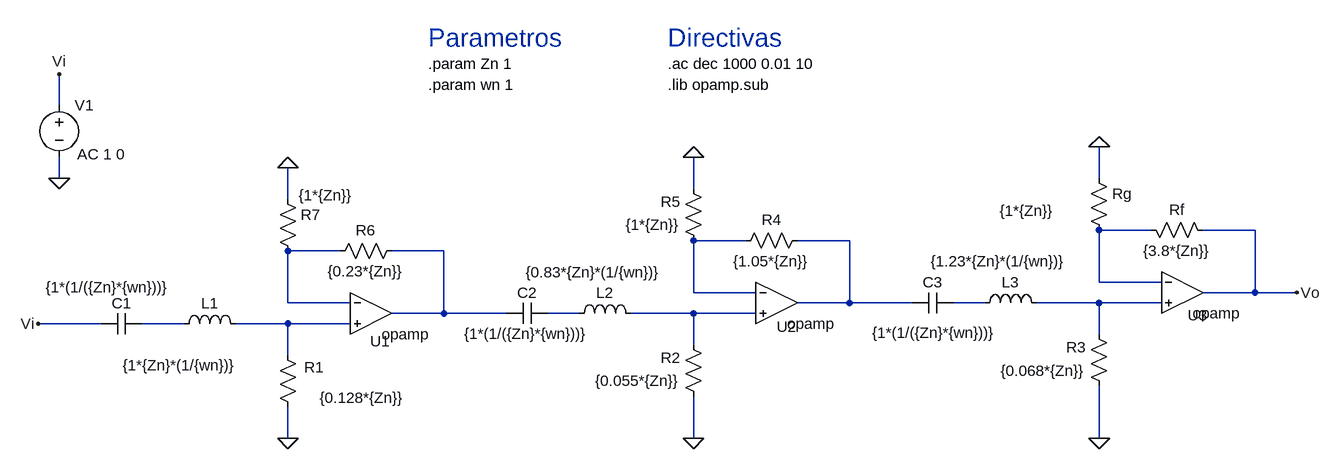
[diagram p0: schematic Circuito_Seroe.asc]
Circuito_Seroe.asc, the LTspice schematic file:
Version 4
SHEET 1 1968 680
WIRE -336 -208 -336 -256
WIRE -336 -96 -336 -128
WIRE 1264 -96 1264 -144
WIRE 640 -80 640 -128
WIRE 16 -64 16 -112
WIRE 1344 -16 1264 -16
WIRE 1504 -16 1424 -16
WIRE 720 0 640 0
WIRE 880 0 800 0
WIRE 96 16 16 16
WIRE 256 16 176 16
WIRE 1264 64 1264 -16
WIRE 1360 64 1264 64
WIRE 640 80 640 0
WIRE 736 80 640 80
WIRE 1504 80 1504 -16
WIRE 1504 80 1424 80
WIRE 1568 80 1504 80
WIRE 16 96 16 16
WIRE 112 96 16 96
WIRE 880 96 880 0
WIRE 880 96 800 96
WIRE 976 96 880 96
WIRE 1088 96 1040 96
WIRE 1264 96 1168 96
WIRE 1360 96 1264 96
WIRE 256 112 256 16
WIRE 256 112 176 112
WIRE 352 112 256 112
WIRE 464 112 416 112
WIRE 640 112 544 112
WIRE 736 112 640 112
WIRE -272 128 -368 128
WIRE -144 128 -208 128
WIRE 16 128 -64 128
WIRE 112 128 16 128
WIRE 1264 144 1264 96
WIRE 640 160 640 112
WIRE 16 176 16 128
WIRE 16 304 16 256
WIRE 640 304 640 240
WIRE 1264 304 1264 224
FLAG 16 304 0
FLAG -368 128 Vi
FLAG -336 -256 Vi
FLAG -336 -96 0
FLAG 640 304 0
FLAG 1264 304 0
FLAG 1568 80 Vo
FLAG 1264 -144 0
FLAG 640 -128 0
FLAG 16 -112 0
SYMBOL OpAmps\\opamp 144 48 R0
WINDOW 0 -1 107 Left 2
SYMATTR InstName U1
SYMBOL res 32 272 R180
WINDOW 0 -40 77 Left 2
WINDOW 3 -164 30 Left 2
SYMATTR InstName R1
SYMATTR Value {0.128*{Zn}}
SYMBOL cap -208 112 R90
WINDOW 3 -56 52 VTop 2
WINDOW 0 0 32 VBottom 2
SYMATTR Value {1*(1/({Zn}*{wn}))}
SYMATTR InstName C1
SYMBOL ind -160 144 R270
WINDOW 0 32 56 VTop 2
WINDOW 3 -32 10 VBottom 2
SYMATTR InstName L1
SYMATTR Value {1*{Zn}*(1/{wn})}
SYMBOL OpAmps\\opamp 768 32 R0
WINDOW 0 0 101 Left 2
SYMATTR InstName U2
SYMBOL res 656 256 R180
WINDOW 0 36 76 Left 2
WINDOW 3 36 40 Left 2
SYMATTR InstName R2
SYMATTR Value {0.055*{Zn}}
SYMBOL cap 416 96 R90
WINDOW 3 32 32 VTop 2
WINDOW 0 0 32 VBottom 2
SYMATTR Value {1*(1/({Zn}*{wn}))}
SYMATTR InstName C2
SYMBOL ind 448 128 R270
WINDOW 0 32 56 VTop 2
WINDOW 3 95 39 VBottom 2
SYMATTR InstName L2
SYMATTR Value {0.83*{Zn}*(1/{wn})}
SYMBOL OpAmps\\opamp 1392 16 R0
WINDOW 0 8 99 Left 2
SYMATTR InstName U3
SYMBOL res 1280 240 R180
WINDOW 0 36 76 Left 2
WINDOW 3 36 40 Left 2
SYMATTR InstName R3
SYMATTR Value {0.068*{Zn}}
SYMBOL cap 1040 80 R90
WINDOW 3 46 28 VTop 2
WINDOW 0 0 32 VBottom 2
SYMATTR Value {1*(1/({Zn}*{wn}))}
SYMATTR InstName C3
SYMBOL ind 1072 112 R270
WINDOW 0 32 56 VTop 2
WINDOW 3 96 38 VBottom 2
SYMATTR InstName L3
SYMATTR Value {1.23*{Zn}*(1/{wn})}
SYMBOL voltage -336 -224 R0
WINDOW 123 28 91 Left 2
WINDOW 39 0 0 Left 0
SYMATTR Value2 AC 1 0
SYMATTR InstName V1
SYMATTR Value ""
SYMBOL res 1248 -112 R0
WINDOW 3 -137 66 Left 2
SYMATTR Value {1*{Zn}}
SYMATTR InstName Rg
SYMBOL res 1328 -32 M90
WINDOW 0 0 56 VBottom 2
WINDOW 3 32 56 VTop 2
SYMATTR InstName Rf
SYMATTR Value {3.8*{Zn}}
SYMBOL res 816 -16 R90
WINDOW 0 0 56 VBottom 2
WINDOW 3 32 56 VTop 2
SYMATTR InstName R4
SYMATTR Value {1.05*{Zn}}
SYMBOL res 656 16 R180
WINDOW 0 36 76 Left 2
WINDOW 3 36 40 Left 2
SYMATTR InstName R5
SYMATTR Value {1*{Zn}}
SYMBOL res 80 32 R270
WINDOW 0 32 56 VTop 2
WINDOW 3 0 56 VBottom 2
SYMATTR InstName R6
SYMATTR Value {0.23*{Zn}}
SYMBOL res 0 -80 R0
WINDOW 3 33 10 Left 2
SYMATTR Value {1*{Zn}}
SYMATTR InstName R7
TEXT 600 -240 Left 2 !.lib opamp.sub
TEXT 232 -272 Left 2 !.param Zn 1
TEXT 232 -240 Left 2 !.param wn 1
TEXT 600 -272 Left 2 !.ac dec 1000 0.01 10
TEXT 232 -312 Left 4 ;Parametros
TEXT 600 -312 Left 4 ;Directivas

The netlist it stands for:
* Circuito_Seroe.asc
XU1 N004 N011 N005 opamp Aol=100K GBW=10Meg  ; pins invin noninvin out
R1 0 N011 {0.128*{Zn}}
C1 N010 Vi {1*(1/({Zn}*{wn}))}
L1 N010 N011 {1*{Zn}*(1/{wn})}
XU2 N002 N009 N003 opamp Aol=100K GBW=10Meg  ; pins invin noninvin out
R2 0 N009 {0.055*{Zn}}
C2 N008 N005 {1*(1/({Zn}*{wn}))}
L2 N008 N009 {0.83*{Zn}*(1/{wn})}
XU3 N001 N007 Vo opamp Aol=100K GBW=10Meg  ; pins invin noninvin out
R3 0 N007 {0.068*{Zn}}
C3 N006 N003 {1*(1/({Zn}*{wn}))}
L3 N006 N007 {1.23*{Zn}*(1/{wn})}
V1 Vi 0 AC 1 0
Rg 0 N001 {1*{Zn}}
Rf N001 Vo {3.8*{Zn}}
R4 N003 N002 {1.05*{Zn}}
R5 N002 0 {1*{Zn}}
R6 N004 N005 {0.23*{Zn}}
R7 0 N004 {1*{Zn}}
.lib opamp.sub
.param Zn 1
.param wn 1
.ac dec 1000 0.01 10
* Parametros
* Directivas
.backanno
.end